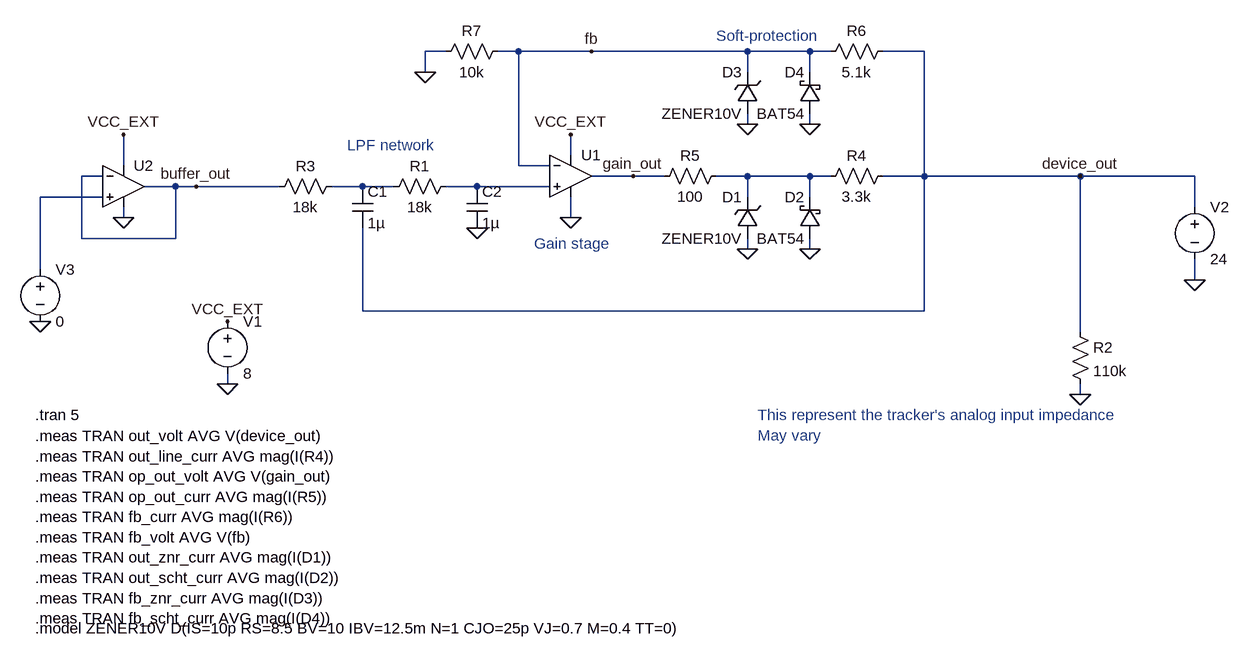
[diagram p0: schematic External Filter Gain - Protection.asc]
External Filter Gain - Protection.asc, the LTspice schematic file:
Version 4.1
SHEET 1 2168 1080
WIRE 640 -352 608 -352
WIRE 752 -352 720 -352
WIRE 864 -352 752 -352
WIRE 1104 -352 864 -352
WIRE 1200 -352 1104 -352
WIRE 1232 -352 1200 -352
WIRE 1376 -352 1312 -352
WIRE 608 -320 608 -352
WIRE 1104 -320 1104 -352
WIRE 1200 -320 1200 -352
WIRE 1104 -240 1104 -256
WIRE 1200 -240 1200 -256
WIRE 832 -192 832 -224
WIRE 144 -176 144 -224
WIRE 752 -176 752 -352
WIRE 800 -176 752 -176
WIRE 112 -160 80 -160
WIRE 928 -160 864 -160
WIRE 976 -160 928 -160
WIRE 1104 -160 1056 -160
WIRE 1200 -160 1104 -160
WIRE 1232 -160 1200 -160
WIRE 1376 -160 1376 -352
WIRE 1376 -160 1312 -160
WIRE 1616 -160 1376 -160
WIRE 1792 -160 1616 -160
WIRE 224 -144 176 -144
WIRE 256 -144 224 -144
WIRE 384 -144 256 -144
WIRE 512 -144 464 -144
WIRE 560 -144 512 -144
WIRE 688 -144 640 -144
WIRE 800 -144 688 -144
WIRE 112 -128 16 -128
WIRE 1104 -128 1104 -160
WIRE 1200 -128 1200 -160
WIRE 1792 -112 1792 -160
WIRE 144 -96 144 -112
WIRE 832 -96 832 -128
WIRE 80 -64 80 -160
WIRE 224 -64 224 -144
WIRE 224 -64 80 -64
WIRE 1104 -48 1104 -64
WIRE 1200 -48 1200 -64
WIRE 16 -16 16 -128
WIRE 1792 0 1792 -32
WIRE 512 48 512 -80
WIRE 1376 48 1376 -160
WIRE 1376 48 512 48
WIRE 1616 80 1616 -160
WIRE 304 160 304 144
WIRE 1616 176 1616 160
FLAG 688 -80 0
FLAG 1616 176 0
FLAG 832 -96 0
FLAG 304 160 0
FLAG 832 -224 VCC_EXT
FLAG 304 64 VCC_EXT
FLAG 1104 -48 0
FLAG 1200 -48 0
FLAG 608 -320 0
FLAG 1104 -240 0
FLAG 1200 -240 0
FLAG 1616 -160 device_out
FLAG 928 -160 gain_out
FLAG 144 -96 0
FLAG 256 -144 buffer_out
FLAG 144 -224 VCC_EXT
FLAG 16 64 0
FLAG 1792 0 0
FLAG 864 -352 fb
SYMBOL res 656 -160 R90
WINDOW 0 0 56 VBottom 2
WINDOW 3 32 56 VTop 2
SYMATTR InstName R1
SYMATTR Value 18k
SYMBOL res 480 -160 R90
WINDOW 0 0 56 VBottom 2
WINDOW 3 32 56 VTop 2
SYMATTR InstName R3
SYMATTR Value 18k
SYMBOL cap 672 -144 R0
SYMATTR InstName C2
SYMATTR Value 1µ
SYMBOL res 1600 64 R0
SYMATTR InstName R2
SYMATTR Value 110k
SYMBOL voltage 304 48 R0
WINDOW 123 0 0 Left 0
WINDOW 39 0 0 Left 0
SYMATTR InstName V1
SYMATTR Value 8
SYMBOL res 1328 -176 R90
WINDOW 0 0 56 VBottom 2
WINDOW 3 32 56 VTop 2
SYMATTR InstName R4
SYMATTR Value 3.3k
SYMBOL schottky 1216 -64 R180
WINDOW 0 24 64 Left 2
WINDOW 3 24 0 Left 2
SYMATTR InstName D2
SYMATTR Value BAT54
SYMATTR Description Diode
SYMATTR Type diode
SYMBOL res 1072 -176 R90
WINDOW 0 0 56 VBottom 2
WINDOW 3 32 56 VTop 2
SYMATTR InstName R5
SYMATTR Value 100
SYMBOL cap 496 -144 R0
SYMATTR InstName C1
SYMATTR Value 1µ
SYMBOL res 1328 -368 R90
WINDOW 0 0 56 VBottom 2
WINDOW 3 32 56 VTop 2
SYMATTR InstName R6
SYMATTR Value 5.1k
SYMBOL res 736 -368 R90
WINDOW 0 0 56 VBottom 2
WINDOW 3 32 56 VTop 2
SYMATTR InstName R7
SYMATTR Value 10k
SYMBOL schottky 1216 -256 R180
WINDOW 0 24 64 Left 2
WINDOW 3 24 0 Left 2
SYMATTR InstName D4
SYMATTR Value BAT54
SYMATTR Description Diode
SYMATTR Type diode
SYMBOL OpAmps\\UniversalOpAmp2 832 -160 R0
SYMATTR InstName U1
SYMBOL OpAmps\\UniversalOpAmp2 144 -144 R0
SYMATTR InstName U2
SYMBOL zener 1120 -256 R180
WINDOW 0 24 64 Left 2
WINDOW 3 24 0 Left 2
SYMATTR InstName D3
SYMATTR Value ZENER10V
SYMATTR Description Diode
SYMATTR Type diode
SYMBOL voltage 1792 -128 R0
WINDOW 123 0 0 Left 0
WINDOW 39 0 0 Left 0
SYMATTR InstName V2
SYMATTR Value 24
SYMBOL voltage 16 -32 R0
WINDOW 123 0 0 Left 0
WINDOW 39 0 0 Left 0
SYMATTR InstName V3
SYMATTR Value 0
SYMBOL zener 1120 -64 R180
WINDOW 0 24 64 Left 2
WINDOW 3 24 0 Left 2
SYMATTR InstName D1
SYMATTR Value ZENER10V
SYMATTR Description Diode
SYMATTR Type diode
TEXT 1056 -376 Left 2 ;Soft-protection
TEXT 488 -208 Left 2 ;LPF network
TEXT 1120 208 Left 2 ;This represent the tracker's analog input impedance\nMay vary
TEXT 776 -56 Left 2 ;Gain stage
TEXT 8 208 Left 2 !.tran 5
TEXT 8 536 Left 2 !.model ZENER10V D(IS=10p RS=8.5 BV=10 IBV=12.5m N=1 CJO=25p VJ=0.7 M=0.4 TT=0)
TEXT 8 240 Left 2 !.meas TRAN out_volt AVG V(device_out)\n.meas TRAN out_line_curr AVG mag(I(R4))\n.meas TRAN op_out_volt AVG V(gain_out)\n.meas TRAN op_out_curr AVG mag(I(R5))\n.meas TRAN fb_curr AVG mag(I(R6))\n.meas TRAN fb_volt AVG V(fb)\n.meas TRAN out_znr_curr AVG mag(I(D1))\n.meas TRAN out_scht_curr AVG mag(I(D2))\n.meas TRAN fb_znr_curr AVG mag(I(D3))\n.meas TRAN fb_scht_curr AVG mag(I(D4))

The netlist it stands for:
* External Filter Gain - Protection.asc
R1 N003 N002 18k
R3 N002 buffer_out 18k
C2 N003 0 1µ
R2 device_out 0 110k
V1 VCC_EXT 0 8
R4 device_out N001 3.3k
D2 0 N001 BAT54
R5 N001 gain_out 100
C1 N002 device_out 1µ
R6 device_out fb 5.1k
R7 fb 0 10k
D4 0 fb BAT54
X§U1 N003 fb VCC_EXT 0 gain_out level2 Avol=1Meg GBW=10Meg Slew=10Meg Ilimit=25m Rail=0 Vos=0 En=0 Enk=0 In=0 Ink=0 Rin=500Meg  ; pins In+ In- V+ V- OUT
X§U2 N004 buffer_out VCC_EXT 0 buffer_out level2 Avol=1Meg GBW=10Meg Slew=10Meg Ilimit=25m Rail=0 Vos=0 En=0 Enk=0 In=0 Ink=0 Rin=500Meg  ; pins In+ In- V+ V- OUT
D3 0 fb ZENER10V
V2 device_out 0 24
V3 N004 0 0
D1 0 N001 ZENER10V
.model D D
.lib standard.dio
* Soft-protection
* LPF network
* This represent the tracker's analog input impedance
* May vary
* Gain stage
.tran 5
.model ZENER10V D(IS=10p RS=8.5 BV=10 IBV=12.5m N=1 CJO=25p VJ=0.7 M=0.4 TT=0)
.meas TRAN out_volt AVG V(device_out)
.meas TRAN out_line_curr AVG mag(I(R4))
.meas TRAN op_out_volt AVG V(gain_out)
.meas TRAN op_out_curr AVG mag(I(R5))
.meas TRAN fb_curr AVG mag(I(R6))
.meas TRAN fb_volt AVG V(fb)
.meas TRAN out_znr_curr AVG mag(I(D1))
.meas TRAN out_scht_curr AVG mag(I(D2))
.meas TRAN fb_znr_curr AVG mag(I(D3))
.meas TRAN fb_scht_curr AVG mag(I(D4))
.lib UniversalOpAmp2.lib
.backanno
.end